# EAGLE schematic Etch_a_Sketch_Back (EAGLE 9.6.2)
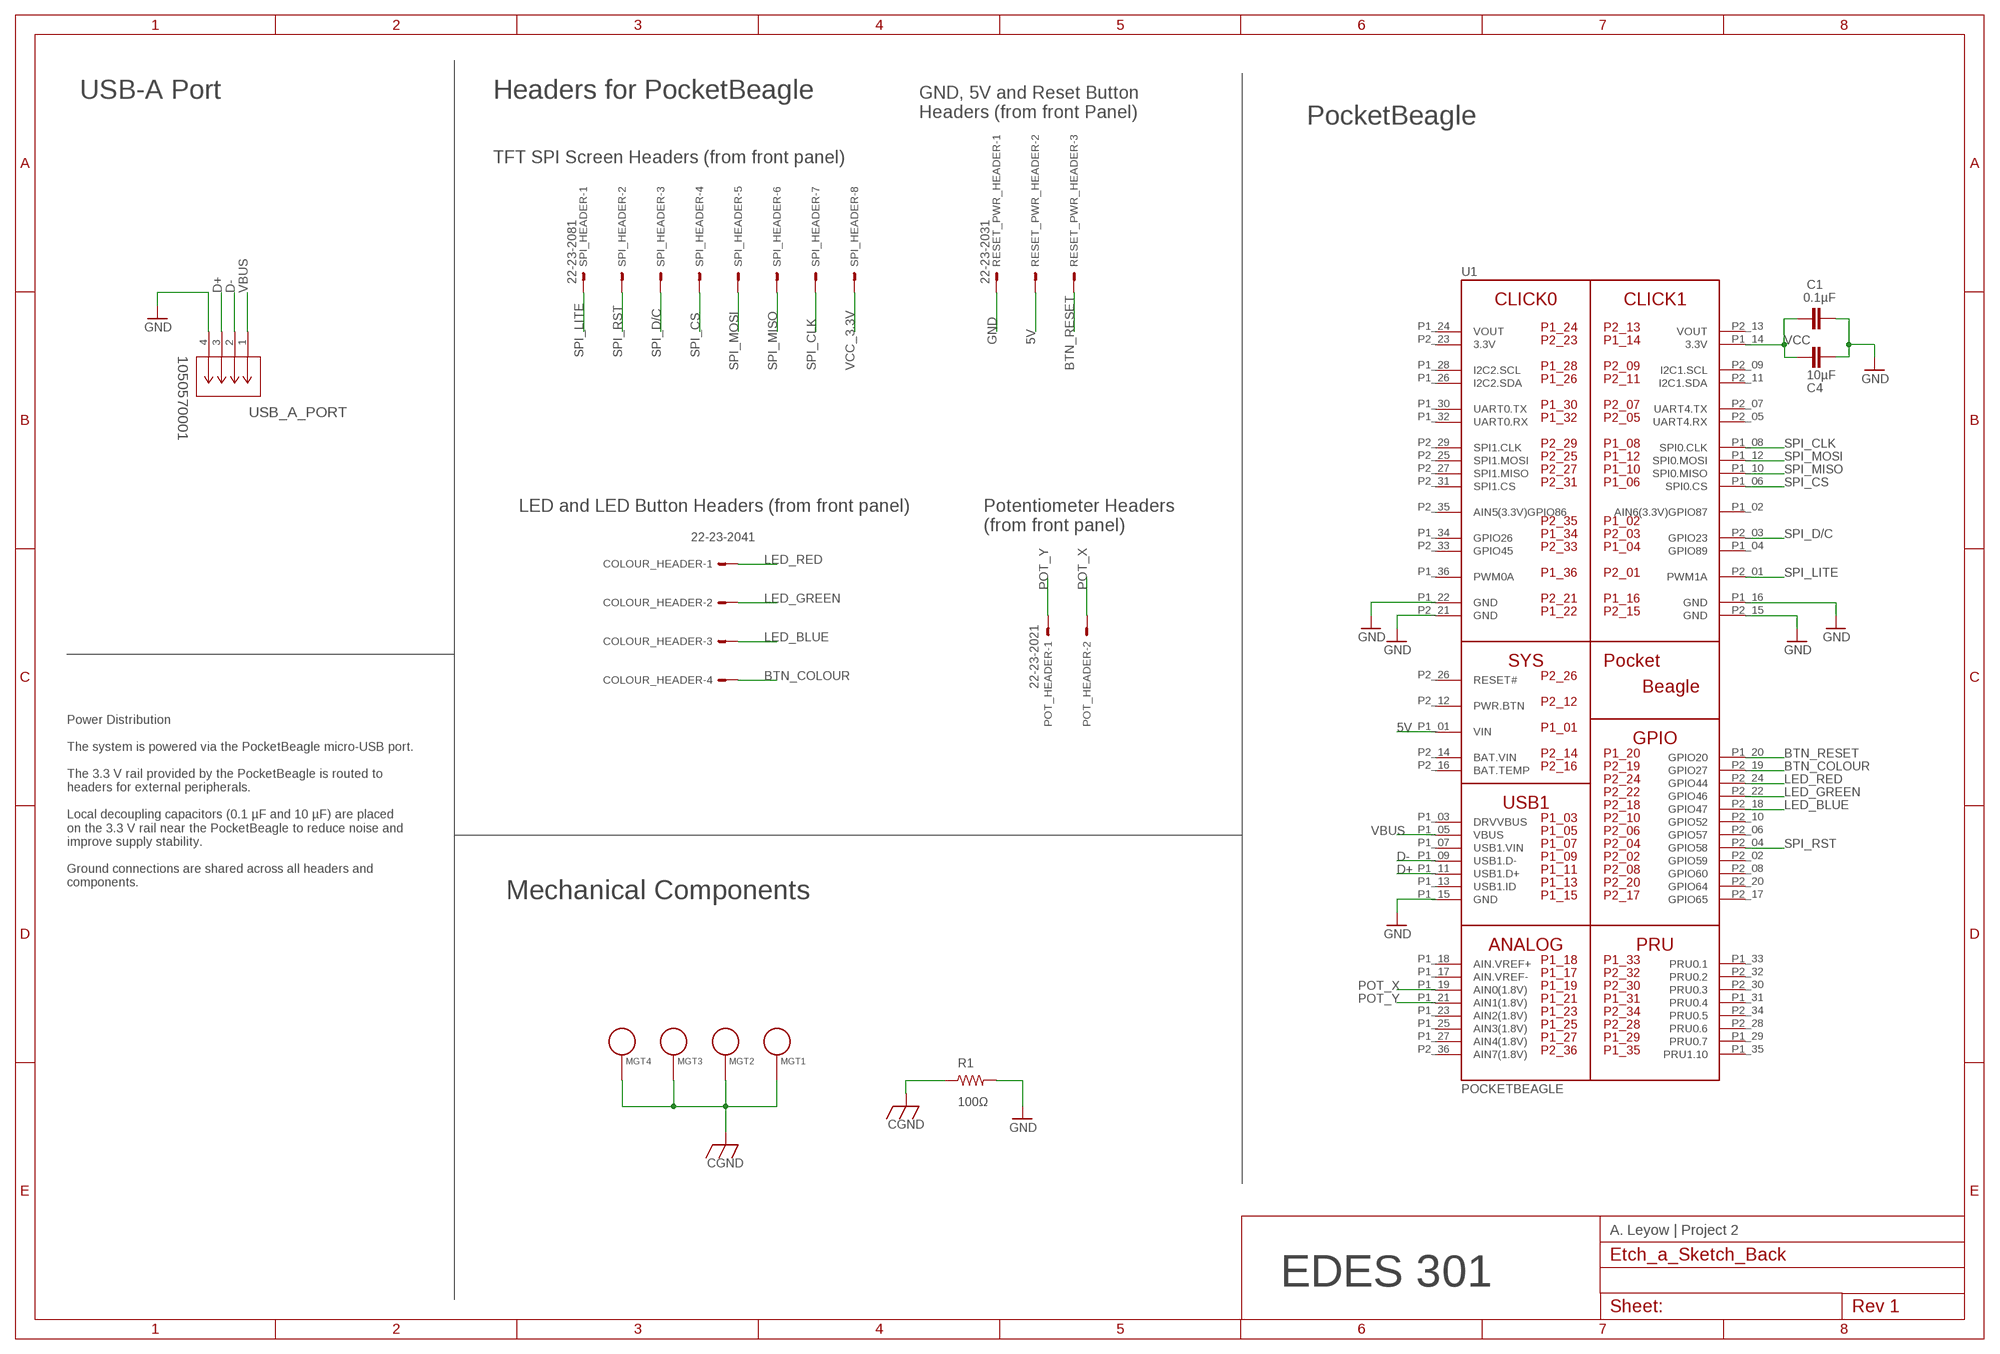
[diagram p0: schematic, sheet 1]

## Parts
C1  0.1µF  C_C0603  [C0603]
C4  10µF  C_C0603  [C0603]
COLOUR_HEADER  22-23-2041  [22-23-2041]
MGT1  MOUNTING_HOLE  [MOUNTING_HOLE]
MGT2  MOUNTING_HOLE  [MOUNTING_HOLE]
MGT3  MOUNTING_HOLE  [MOUNTING_HOLE]
MGT4  MOUNTING_HOLE  [MOUNTING_HOLE]
POT_HEADER  22-23-2021  [22-23-2021]
R1  100Ω  R_R0805  [R0805]
RESET_PWR_HEADER  22-23-2031  [22-23-2031]
SPI_HEADER  22-23-2081  [22-23-2081]
U1  POCKETBEAGLE  [POCKETBEAGLE]
USB_A_PORT  1050570001  [CONN_1050570001_MOL]

## Nets
5V: RESET_PWR_HEADER.2 U1.P1_01(VIN)
BTN_COLOUR: COLOUR_HEADER.4 U1.P2_19(GPIO27)
BTN_RESET: RESET_PWR_HEADER.3 U1.P1_20(GPIO20)
CGND [GND]: MGT1.P$1 MGT2.P$1 MGT3.P$1 MGT4.P$1 R1.1
D+: U1.P1_11(USB1.D+) USB_A_PORT.3
D-: U1.P1_09(USB1.D-) USB_A_PORT.2
GND [GND]: C1.2 C4.2 R1.2 RESET_PWR_HEADER.1 U1.P1_15(GND) U1.P1_16(GND) U1.P1_22(GND) U1.P2_15(GND) U1.P2_21(GND) USB_A_PORT.4
LED_BLUE: COLOUR_HEADER.3 U1.P2_18(GPIO47)
LED_GREEN: COLOUR_HEADER.2 U1.P2_22(GPIO46)
LED_RED: COLOUR_HEADER.1 U1.P2_24(GPIO44)
POT_X: POT_HEADER.2 U1.P1_19(AIN0(1.8V))
POT_Y: POT_HEADER.1 U1.P1_21(AIN1(1.8V))
SPI_CLK: SPI_HEADER.7 U1.P1_08(SPI0.CLK)
SPI_CS: SPI_HEADER.4 U1.P1_06(SPI0.CS)
SPI_D/C: SPI_HEADER.3 U1.P2_03(GPIO23)
SPI_LITE: SPI_HEADER.1 U1.P2_01(PWM1A)
SPI_MISO: SPI_HEADER.6 U1.P1_10(SPI0.MISO)
SPI_MOSI: SPI_HEADER.5 U1.P1_12(SPI0.MOSI)
SPI_RST: SPI_HEADER.2 U1.P2_04(GPIO58)
VBUS: U1.P1_05(VBUS) USB_A_PORT.1
VCC [VCC]: C1.1 C4.1 U1.P1_14(3.3V)
VCC_3.3V [VCC]: SPI_HEADER.8
Unconnected: U1.P1_02(AIN6(3.3V)GPIO87) U1.P1_03(DRVVBUS) U1.P1_04(GPIO89) U1.P1_07(USB1.VIN) U1.P1_13(USB1.ID) U1.P1_17(AIN.VREF-) U1.P1_18(AIN.VREF+) U1.P1_23(AIN2(1.8V)) U1.P1_25(AIN3(1.8V)) U1.P1_26(I2C2.SDA) U1.P1_27(AIN4(1.8V)) U1.P1_28(I2C2.SCL) U1.P1_29(PRU0.7) U1.P1_30(UART0.TX) U1.P1_31(PRU0.4) U1.P1_32(UART0.RX) U1.P1_33(PRU0.1) U1.P1_34(GPIO26) U1.P1_35(PRU1.10) U1.P1_36(PWM0A) U1.P2_02(GPIO59) U1.P2_05(UART4.RX) U1.P2_06(GPIO57) U1.P2_07(UART4.TX) U1.P2_08(GPIO60) U1.P2_09(I2C1.SCL) U1.P2_10(GPIO52) U1.P2_11(I2C1.SDA) U1.P2_12(PWR.BTN) U1.P2_16(BAT.TEMP) U1.P2_17(GPIO65) U1.P2_20(GPIO64) U1.P2_25(SPI1.MOSI) U1.P2_26(RESET#) U1.P2_27(SPI1.MISO) U1.P2_28(PRU0.6) U1.P2_29(SPI1.CLK) U1.P2_30(PRU0.3) U1.P2_31(SPI1.CS) U1.P2_32(PRU0.2) U1.P2_33(GPIO45) U1.P2_34(PRU0.5) U1.P2_35(AIN5(3.3V)GPIO86) U1.P2_36(AIN7(1.8V))

## Notes on the sheet
- USB-A Port | Headers for PocketBeagle | GND, 5V and Reset Button
- Headers (from front Panel)
- PocketBeagle
- TFT SPI Screen Headers (from front panel)
- LED and LED Button Headers (from front panel) | Potentiometer Headers
- (from front panel)
- Power Distribution
  
  The system is powered via the PocketBeagle micro-USB port.
  
  The 3.3 V rail provided by the PocketBeagle is routed to 
  headers for external peripherals.
  
  Local decoupling capacitors (0.1 µF and 10 µF) are placed 
  on the 3.3 V rail near the PocketBeagle to reduce noise and 
  improve supply stability.
  
  Ground connections are shared across all headers and 
  components.
- Mechanical Components
- A. Leyow | Project 2
- EDES 301

## Power pins joined to a net without a drawn wire
3.3V: U1.P2_23(3.3V)
BAT.VIN: U1.P2_14(BAT.VIN)
VOUT: U1.P1_24(VOUT) U1.P2_13(VOUT)

## Library data of the parts
C1 C4 = MISC:C_: Capacitor SMD. Sizes: 0402, 0603 & 0805
COLOUR_HEADER = Etch_a_Sketch:22-23-2041: .100" (2.54mm) Center Header - 4 Pin; MF: MOLEX; MPN: 22-23-2041; OC_FARNELL: 1462920; OC_NEWARK: 38C0355
MGT1-MGT4 = combo_lock:MOUNTING_HOLE: Chassis Mounting Hole w/GND connection ability
POT_HEADER = Etch_a_Sketch:22-23-2021: .100" (2.54mm) Center Header - 2 Pin; MF: MOLEX; MPN: 22-23-2021; OC_FARNELL: 1462926; OC_NEWARK: 25C3832
R1 = Etch_a_Sketch:R_: RESISTOR, American symbol
RESET_PWR_HEADER = Etch_a_Sketch:22-23-2031: .100" (2.54mm) Center Header - 3 Pin; MF: MOLEX; MPN: 22-23-2031; OC_FARNELL: 1462950; OC_NEWARK: 30C0862
SPI_HEADER = Etch_a_Sketch:22-23-2081: .100" (2.54mm) Center Header - 8 Pin; MF: MOLEX; MPN: 22-23-2081; OC_FARNELL: 1756826; OC_NEWARK: 01C7592
U1 = combo_lock:POCKETBEAGLE
USB_A_PORT = Etch_a_Sketch:1050570001: Check availability <https://pricing.snapeda.com/parts/1050570001/Molex/view-part?ref=eda>; AVAILABILITY: In Stock; CHECK_PRICES: https://www.snapeda.com/parts/1050570001/Molex/view-part/?ref=eda; DESCRIPTION: USB-A (USB TYPE-A) USB 2.0 Receptacle Connector 4 Position Through Hole; MF: Molex; MP: 1050570001; PACKAGE: None; PRICE: None; PURCHASE-URL: https://www.snapeda.com/api/url_track_click_mouser/?unipart_id=2769818&manufacturer=Molex&part_name=1050570001&search_term=usb-a host; SNAPEDA_LINK: https://www.snapeda.com/parts/1050570001/Molex/view-part/?ref=snap

## Net classes
0 Signal: width 0.254 mm, drill 0.305 mm, clearance 0.254 mm
1 VCC: width 0.381 mm, drill 0.305 mm, clearance 0.381 mm
2 GND: width 0.381 mm, drill 0.305 mm, clearance 0.381 mm